# Altium schematic sheet 09_POWER.SchDoc: DCDC Power Supply / Misc.
size 381 x 266 mm; Organization: Meteroi; Address1: Room 428, 410 Guiping Rd.; Address2: Shanghai 200233, CHINA; SheetNumber: 9; SheetTotal: 9; PageSetup: Record=PageOptions|CenterHorizontal=True|CenterVertical=True|PrintScale=0.75|XCorrection=1.00|YCorrection=1.00|PrintKind=2|BorderSize=5000000|LeftOffset=0|BottomOffset=0|Orientation=2|PaperLength=1000|PaperWidth=1000|Scale=100|PaperSource=276|PrintQuality=-3|MediaType=1|DitherType=10|PaperKind=A4|PrintScaleMode=1
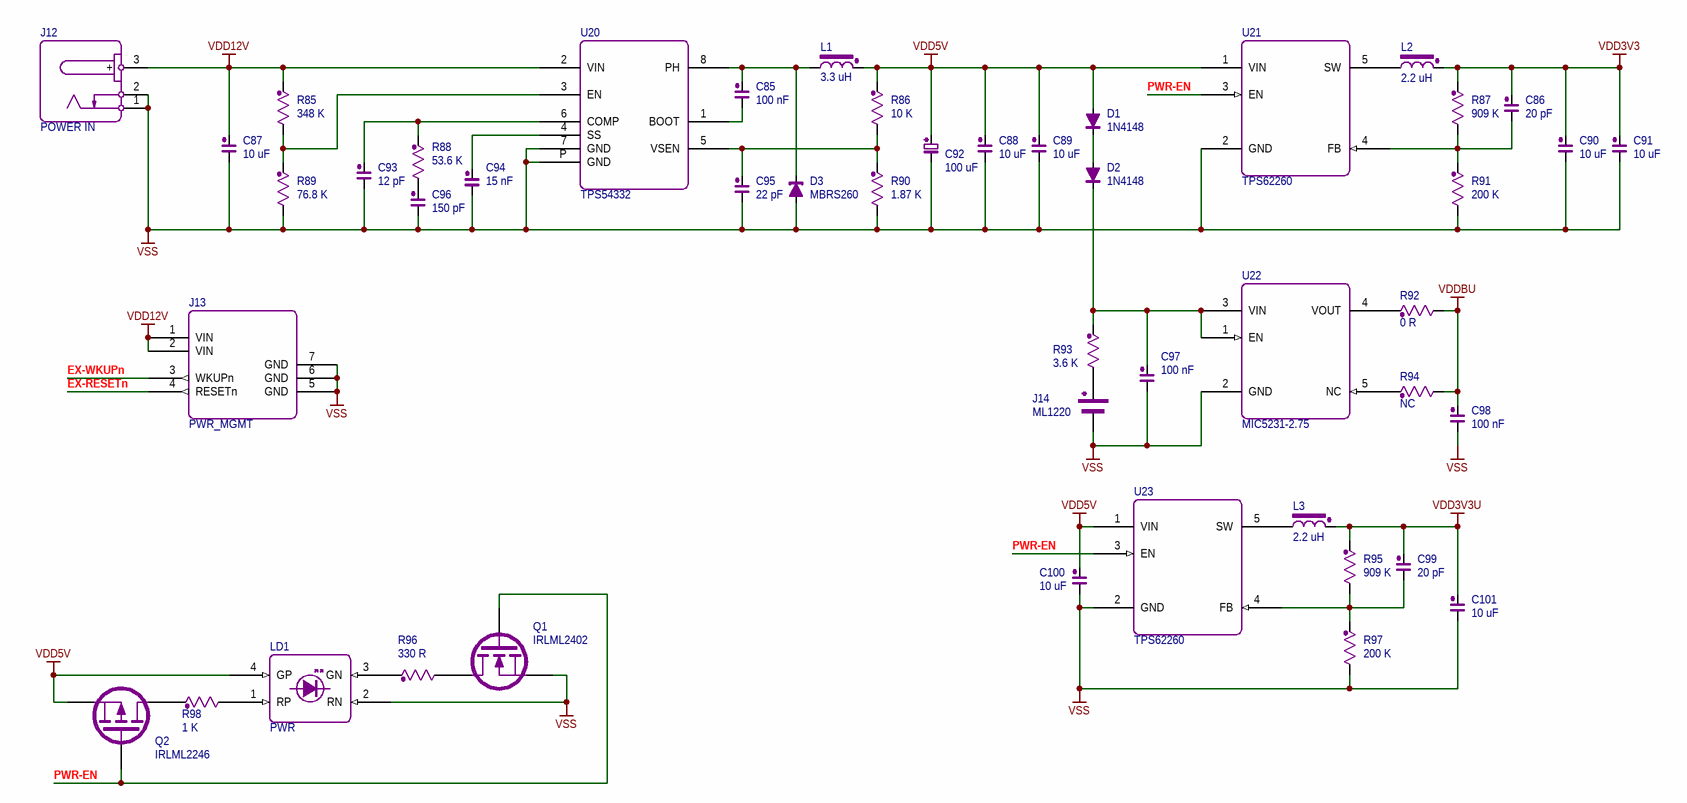
[diagram p0: 09_POWER.SchDoc]

## Parts
C85  100 nF  [0603A1]
C86  20 pF  [0402A1]
C87  10 uF  [1210A1]
C88  10 uF  [0603A1]
C89  10 uF  [0603A1]
C90  10 uF  [0603A1]
C91  10 uF  [0603A1]
C92  100 uF  [CAP_ED]
C93  12 pF  [0603A1]
C94  15 nF  [0603A1]
C95  22 pF  [0603A1]
C96  150 pF  [0603A1]
C97  100 nF  [0603A1]
C98  100 nF  [0603A1]
C99  20 pF  [0402A1]
C100  10 uF  [0603A1]
C101  10 uF  [0603A1]
D1  1N4148  [SOD-123]
D2  1N4148  [SOD-123]
D3  MBRS260  [D-SMB]
J12  POWER IN  [PWRIN_JACK_1]
J13  PWR_MGMT  [PWR_MGMT]
J14  ML1220  [BAT_SCKT_1220]
L1  3.3 uH  [COIL_S_7X7]
L2  2.2 uH  [COIL_S_3X3]
L3  2.2 uH  [COIL_S_3X3]
LD1  PWR  [LED_4A_S_S195]
Q1  IRLML2402  [SOT-23-3]
Q2  IRLML2246  [SOT-23-3]
R85  348 K  [0603A2]
R86  10 K  [0603A2]
R87  909 K  [0402A2]
R88  53.6 K  [0603A2]
R89  76.8 K  [0603A2]
R90  1.87 K  [0603A2]
R91  200 K  [0402A2]
R92  0 R  [0402A2]
R93  3.6 K  [0603A2]
R94  NC  [0402A2]
R95  909 K  [0402A2]
R96  330 R  [0402A2]
R97  200 K  [0402A2]
R98  1 K  [0402A2]
U20  TPS54332  [SOIC-8SE]
U21  TPS62260  [SOT-23-5]
U22  MIC5231-2.75  [SOT-23-5]
U23  TPS62260  [SOT-23-5]

## Nets
VDD3V3: C86.2 C90.2 C91.2 L2.2 R87.2
VDD3V3U: C99.2 C101.2 L3.2 R95.2
VDD5V: C88.2 C89.2 C92.2 C100.2 D1.2 L1.2 LD1.4(GP) Q2.3(S) R86.2 U21.1(VIN) U23.1(VIN)
VDD12V: C87.2 J12.3(+) J13.1(VIN) J13.2(VIN) R85.2 U20.2(VIN)
VDDBU: C98.2 R92.1 R94.1
VSS: C87.1 C88.1 C89.1 C90.1 C91.1 C92.1 C93.1 C94.1 C95.1 C96.1 C97.1 C98.1 C100.1 C101.1 D3.2 J12.1(-) J12.2(J) J13.5(GND) J13.6(GND) J13.7(GND) J14.1 LD1.2(RN) Q1.3(S) R89.1 R90.1 R91.1 R97.1 U20.7(GND) U20.P(GND) U21.2(GND) U22.2(GND) U23.2(GND)
EX-RESETn: J13.4(RESETn)
EX-WKUPn: J13.3(WKUPn)
PWR-EN: Q1.1(G) Q2.1(G) U21.3(EN) U23.3(EN)
NetC85_1: C85.1 U20.1(BOOT)
NetC85_2: C85.2 D3.1 L1.1 U20.8(PH)
NetC86_1: C86.1 R87.1 R91.2 U21.4(FB)
NetC93_2: C93.2 R88.2 U20.6(COMP)
NetC94_2: C94.2 U20.4(SS)
NetC95_2: C95.2 R86.1 R90.2 U20.5(VSEN)
NetC96_2: C96.2 R88.1
NetC97_2: C97.2 D2.1 R93.2 U22.1(EN) U22.3(VIN)
NetC99_1: C99.1 R95.1 R97.2 U23.4(FB)
NetD1_1: D1.1 D2.2
NetJ14_2: J14.2 R93.1
NetL2_1: L2.1 U21.5(SW)
NetL3_1: L3.1 U23.5(SW)
NetLD1_1: LD1.1(RP) R98.1
NetLD1_3: LD1.3(GN) R96.2
NetQ1_2: Q1.2(D) R96.1
NetQ2_2: Q2.2(D) R98.2
NetR85_1: R85.1 R89.2 U20.3(EN)
NetR92_2: R92.2 U22.4(VOUT)
NetR94_2: R94.2 U22.5(NC)

## Notes on the sheet
- Title:
- Project:
- Sheet:
- Of
- Size:
- D/N:
- Rev:
- Date:
- P/N:
- S/N:
- Designer:
- C

## Library data of the parts
C85-C89 C93-C100 = CAP: Normal Capacitor; PartNumber: 0; Vendor: muRata; Designer: shyul; PinCountSMD: 2; SerialNumber: 0; Publisher: Cowin; PCBMarker: Capacitor; Version: 1.0; VersionDate: 04-27-2011; PinCountHole: 0
  C85 C97 C98: Value: 100 nF
  C86 C99: Value: 20 pF
  C87-C89 C100: Value: 10 uF
  C93: Value: 12 pF
  C94: Value: 15 nF
  C95: Value: 22 pF
  C96: Value: 150 pF
C90 C91 C101 = CAP: Normal Capacitor; PartNumber: 0; Value: 100 nF; Vendor: muRata; Designer: shyul; PinCountSMD: 2; SerialNumber: 0; Publisher: Cowin; PCBMarker: Capacitor; Version: 1.0; VersionDate: 04-27-2011; PinCountHole: 0
C92 = CAP_E: Electrolyte Capacitor; PartNumber: 0; Designer: shyul; Vendor: AVX; PinCountSMD: 2; SerialNumber: 0; PCBMarker: Capacitor; Publisher: Cowin; Value: 100 uF; Version: 1.0; VersionDate: 04-27-2011; PinCountHole: 0
D1 D2 = DIODE: Normal Diode; PartNumber: 0; Vendor: ONSemi; Designer: shyul; Value: 1N4148; SerialNumber: 0; Version: 1.0; VersionDate: 04-27-2011; Publisher: Cowin; PCBMarker: Diode
D3 = DIODE_S: Schottky Diode; PartNumber: 0; Vendor: ONSemi; Designer: shyul; PinCountSMD: 2; SerialNumber: 0; Value: MBRS260; Version: 1.0; VersionDate: 04-27-2011; Publisher: Cowin; PCBMarker: Schottky Diode; PinCountHole: 0
J12 = PWRIN_JACK_1: Standard Power Input Type 1; PartNumber: *; PCBMarker: *; SerialNumber: *; Vendor: *
J13 = PWR_MGMT: Lophilo Power Management; Vendor: 0; PinCountHole: 7; Designer: shyul; Value: PWR_MGMT; PartNumber: PWR_MGMT; Version: 1.0; VersionDate: 03-27-2012; PinCountSMD: 0; SerialNumber: 0; Publisher: Cowin; PCBMarker: PWR_MGMT
J14 = BAT_A: Battery; PartNumber: SOCKET_1220; SerialNumber: 0; Vendor: AMP; Designer: shyul; Value: ML1220; VersionDate: 04-29-2011; Version: 1.0; Publisher: Cowin; PCBMarker: ML1220
L1 = COIL: Power Coil Inductor; PartNumber: MPLCH0740L3R3(SA); Vendor: NEC / TOKIN; Designer: shyul; PCBMarker: Power Inductor; SerialNumber: 0; PinCountSMD: 2; Value: 3.3 uH; Version: 1.0; VersionDate: 04-27-2011; Publisher: Cowin; PinCountHole: 0
L2 L3 = COIL: Power Coil Inductor; PartNumber: LPS3010-222MLB; Vendor: Coilcraft; Designer: shyul; PCBMarker: Power Inductor; SerialNumber: 0; PinCountSMD: 2; Value: 2.2 uH; Version: 1.0; VersionDate: 04-27-2011; Publisher: Cowin; PinCountHole: 0
LD1 = LED_2A: LED Pack 2; PartNumber: LL-S195VUGC-2B; Value: RG; Designer: shyul; SerialNumber: 0; Vendor: Luckylight; PinCountSMD: 4; Status: PWR; Version: 1.0; VersionDate: 04-27-2011; Publisher: Cowin; PCBMarker: LED; PinCountHole: 0
Q1 = MOSFET_EN: N Channel Enhancement MOSFET; PartNumber: 0; Designer: shyul; Vendor: IR; PinCountSMD: 3; SerialNumber: 0; Publisher: Cowin; Value: IRLML2402; PCBMarker: IRLML2402; Version: 0.1; VersionDate: 04-28-2011; PinCountHole: 0
Q2 = MOSFET_EP: P Channel Enhancement MOSFET; PartNumber: IRLML2246TRPbF; Vendor: ONSemi; Designer: shyul; SerialNumber: 0; PinCountSMD: 3; Value: IRLML2246; Version: 0.1; VersionDate: 04-28-2011; Publisher: Cowin; PCBMarker: MOSFET; PinCountHole: 0
R85-R98 = RES: Normal Resistor; PartNumber: 0; Vendor: KOA; Designer: shyul; PinCountSMD: 2; SerialNumber: 0; Version: 1.0; VersionDate: 04-27-2011; PCBMarker: Resistor; Publisher: Cowin; PinCountHole: 0
  R85: Value: 348 K
  R86: Value: 10 K
  R87 R95: Value: 909 K
  R88: Value: 53.6 K
  R89: Value: 76.8 K
  R90: Value: 1.87 K
  R91 R97: Value: 200 K
  R92: Value: 0 R
  R93: Value: 3.6 K
  R94: Value: NC
  R96: Value: 330 R
  R98: Value: 1 K
U20 = TPS54332: TI Simple Switch Adjustable 3A; PartNumber: TPS54332DDAR; SerialNumber: 0; PinCountSMD: 9; Designer: shyul; PCBMarker: Power; Value: TPS54332; Version: 1.0; VersionDate: 05-08-2011; Vendor: TI; PinCountHole: 0; Publisher: Cowin; Supplier 1: Digi-Key; Supplier Part Number 1: 296-24141-5-ND
U21 U23 = TPS62260: Simple Switch 600mA Adjustable; PartNumber: TPS62260DDCR; Vendor: TI; PinCountSMD: 5; PinCountHole: 0; Designer: shyul; PCBMarker: Power; Value: TPS62260; Version: 1.0; VersionDate: 05-08-2011; SerialNumber: 0; Publisher: Cowin; Supplier 1: Digi-Key; Supplier Part Number 1: 296-22469-2-ND
U22 = MIC5231: LDO Micro; PartNumber: MIC5231-2.75YM5; Vendor: Micrel; PinCountSMD: 5; PinCountHole: 0; Designer: shyul; Value: MIC5231-2.75; Version: 1.0; VersionDate: 03-27-2012; SerialNumber: 0; Publisher: Cowin; PCBMarker: LDO